# EAGLE design CatuDaya (EAGLE 9.0.1)
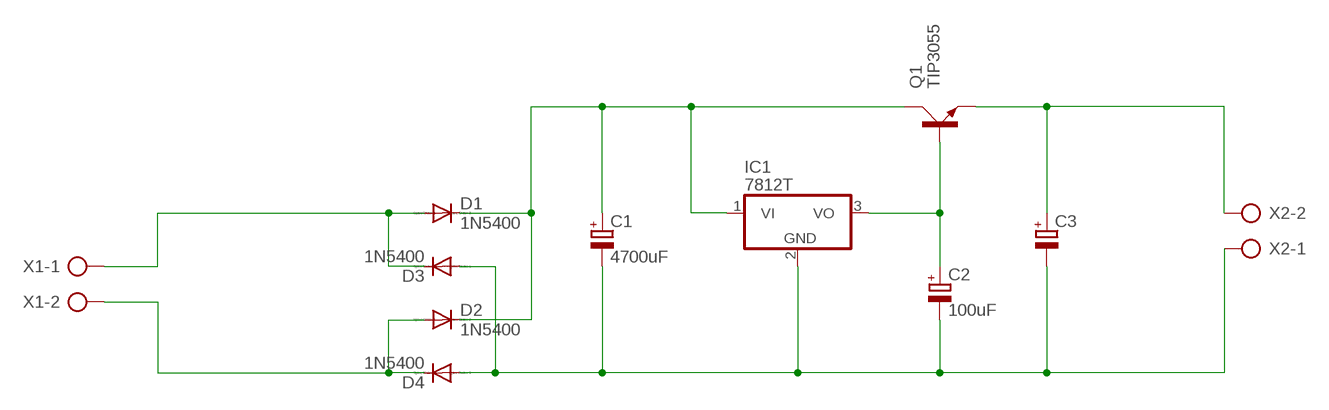
[diagram p0: schematic, sheet 1]

## Parts
C1  4700uF  CPOL-EUE7.5-16  [E7,5-16]
C2  100uF  CPOL-EUE2.5-5  [E2,5-5]
C3  CPOL-EUE5-10.5  [E5-10,5]
D1  1N5400  [DO201-15]
D2  1N5400  [DO201-15]
D3  1N5400  [DO201-15]
D4  1N5400  [DO201-15]
IC1  7812T  [TO220H]
Q1  TIP3055  [TOP3AV]
X1  AK300/2  [AK300/2]
X2  AK300/2  [AK300/2]

## Nets
N$1: C1.+ D1.C D2.C IC1.1(VI) Q1.C
N$2: D1.A D3.C X1.1
N$3: D2.A D4.C X1.2
N$4: C1.- C2.- C3.- D3.A D4.A IC1.2(GND) X2.1
N$5: C3.+ Q1.E X2.2
N$6: C2.+ IC1.3(VO) Q1.B

## Library data of the parts
C1-C3 = resistor:CPOL-EU: POLARIZED CAPACITOR, European symbol
D1-D4 = diode:1N5400: DIODE standard rectifier, 3 A, 50 V (Motorola)
IC1 = linear:78*: Positive VOLTAGE REGULATOR Source: http://cache.national.com/ds/LM/LM78L05.pdf http://www.fairchildsemi.com/ds/LM/LM7805.pdf
Q1 = transistor-power:TIP3055: NPN TRANSISTOR
X1 X2 = con-ptr500:AK300/2: CONNECTOR; OC_FARNELL: unknown; OC_NEWARK: unknown

## Board
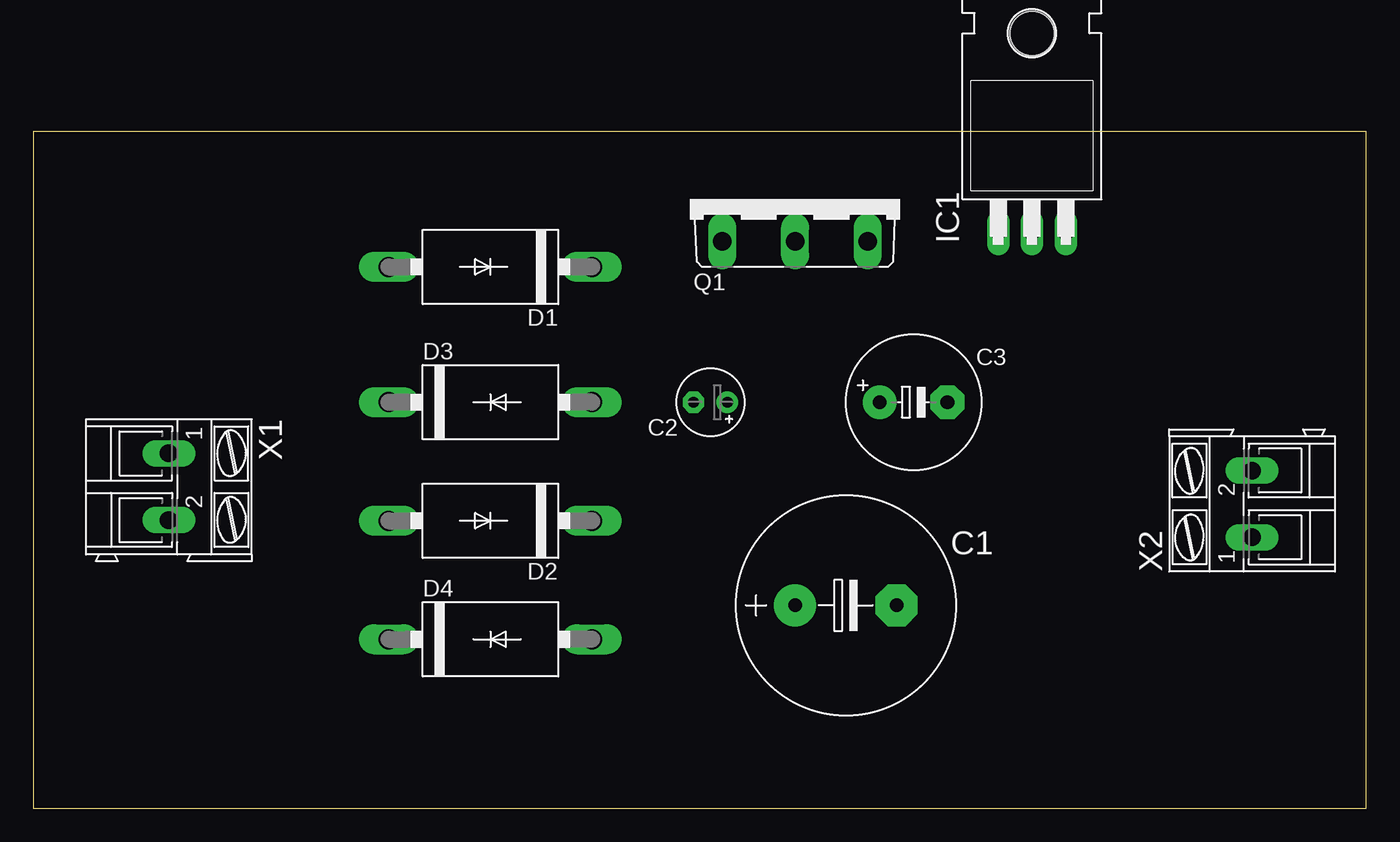
[diagram p1: board, top side]
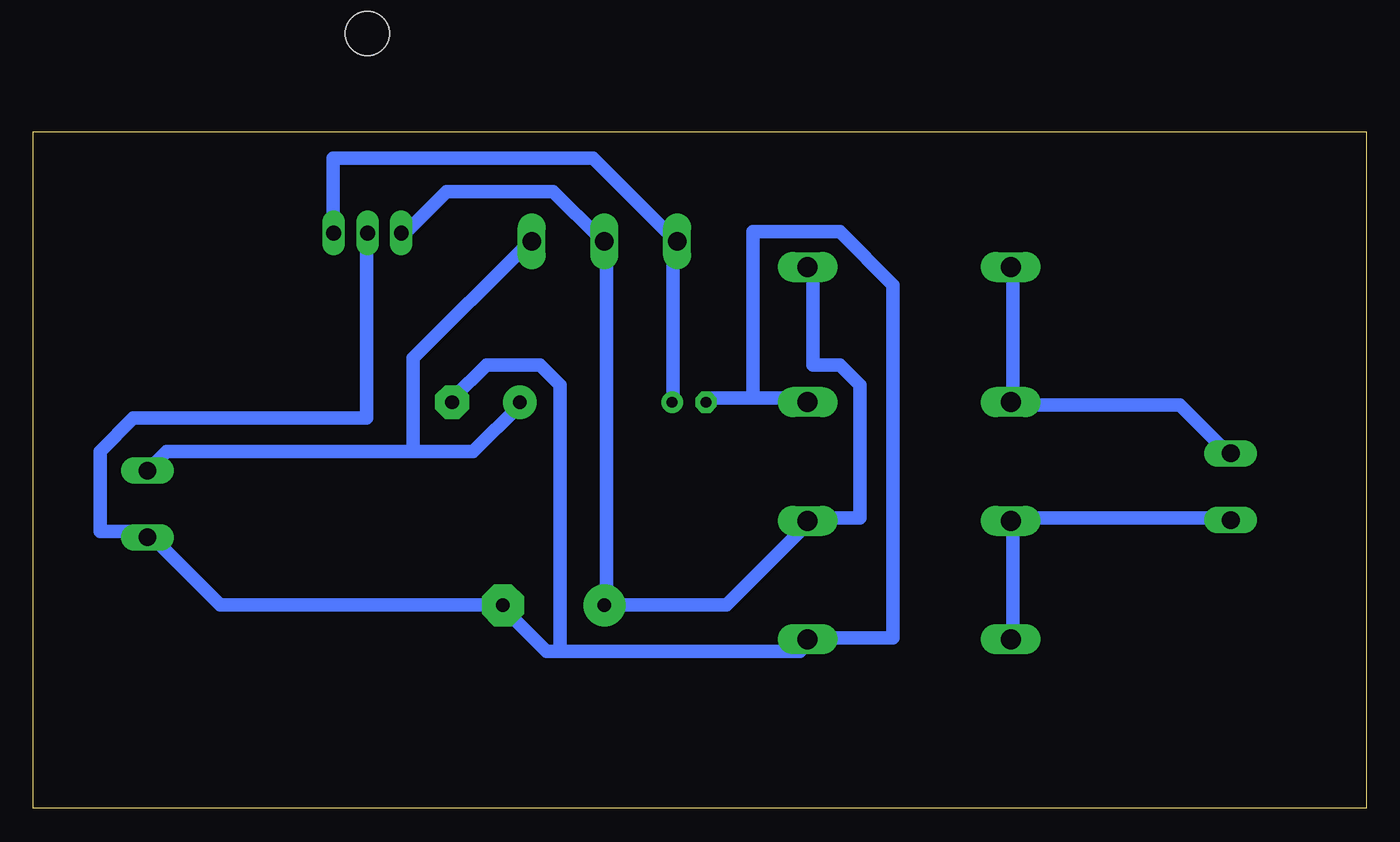
[diagram p2: board, bottom side, seen from below]

Size 100 x 50.79 mm. Coordinates in mm from the lower left corner, seen from the top.
Outline: 0,0 100,0 100,50.79 0,50.79 0,0
Copper layers (1*16): Top 0.035mm / dielectric 1.5mm / Bottom 0.035mm
Design rules "default *": minimum track width 40mil, minimum drill 0.6mm, track to track 40mil, track to pad 40mil, pad to pad 6mil, via to via 6mil, smd to smd 6mil, copper to edge 40mil, drill to drill 10mil, minimum pad ring 10mil, minimum via ring 8mil, stop-mask expansion 4mil, vias tented up to drill 0mil, thermal gap 10mil

### Footprints (pad centres in the part's own frame; a part is rotated, then mirrored left to right if it is on the bottom)
E7,5-16 = drill 1.016 pad 3.15: + -3.81,0 | drill 1.016 pad 3.15 octagon: - 3.81,0
E2,5-5 = drill 0.813 pad 1.6: + -1.27,0 | drill 0.813 pad 1.6 octagon: - 1.27,0
E5-10,5 = drill 1.016 pad 2.54: + -2.54,0 | drill 1.016 pad 2.54 octagon: - 2.54,0
DO201-15 = drill 1.499 long: A 7.62,0; C -7.62,0
TO220H = drill 1.118 long: 1 -2.54,-10.16; 2 0,-10.16; 3 2.54,-10.16 | hole 3.302: 0,4.826
TOP3AV = drill 1.397 long: B -5.461,-3.175; C 0,-3.175; E 5.461,-3.175
AK300/2 = drill 1.321 long: 1 -2.515,0; 2 2.489,0

### Placement (x,y rotation side)
C1  60.96,15.24 0 top
C2  50.8,30.48 180 top
C3  66.04,30.48 0 top
D1  34.29,40.64 180 top
D2  34.29,21.59 180 top
D3  34.29,30.48 0 top
D4  34.29,12.7 0 top
IC1  74.93,53.34 0 top
Q1  57.15,45.72 0 top
X1  10.16,24.13 270 top
X2  91.44,22.86 90 top

### Tracks (layer width: path | path; a pad name or v marks a point on that pad's centre or on a via)
N$1
  Bottom 1.016: IC1.1 72,43.29 69,46.29 61,46.29 57.5,42.79 Q1.C 57,42.29 57,15.79 C1.+ 57,15.29 48,15.29 42,21.29 D2.C 41.5,21.79 38,21.79 38,31.79 39.5,33.29 41.5,33.29 41.5,40.29 D1.C
N$2
  Bottom 1.016: X1.1 10.5,26.79 14,30.29 26.5,30.29 D3.C 26.5,30.79 26.5,40.29 D1.A
N$3
  Bottom 1.016: X1.2 10.5,21.79 26.5,21.79 D2.A 26.5,21.29 26.5,12.79 D4.C
N$4
  Bottom 1.016: IC1.2 75,42.79 75,29.29 92.5,29.29 95,26.79 95,20.79 91.5,20.79 X2.1 91,20.29 86,15.29 65,15.29 C1.- 64.5,14.79 61.5,11.79 60.5,11.79 | 46,30.79 42,30.79 D3.A | 46,30.79 49.5,30.79 C2.- | 60.5,11.79 42.5,11.79 42,12.29 D4.A 41.5,12.79 35.5,12.79 35.5,39.29 39.5,43.29 46,43.29 46,30.79 | 60.5,11.79 60.5,31.79 62,33.29 66,33.29 68.5,30.79 C3.-
N$5
  Bottom 1.016: 71.5,26.79 67,26.79 63.5,30.29 C3.+ | 71.5,26.79 90,26.79 91,25.79 X2.2 | 71.5,26.79 71.5,33.79 63,42.29 Q1.E
N$6
  Bottom 1.016: C2.+ 52,30.79 52,42.29 Q1.B 52,42.79 58,48.79 77.5,48.79 77.5,43.29 IC1.3